# EAGLE design GCD_MiniMoto_v2 (EAGLE 6.3)
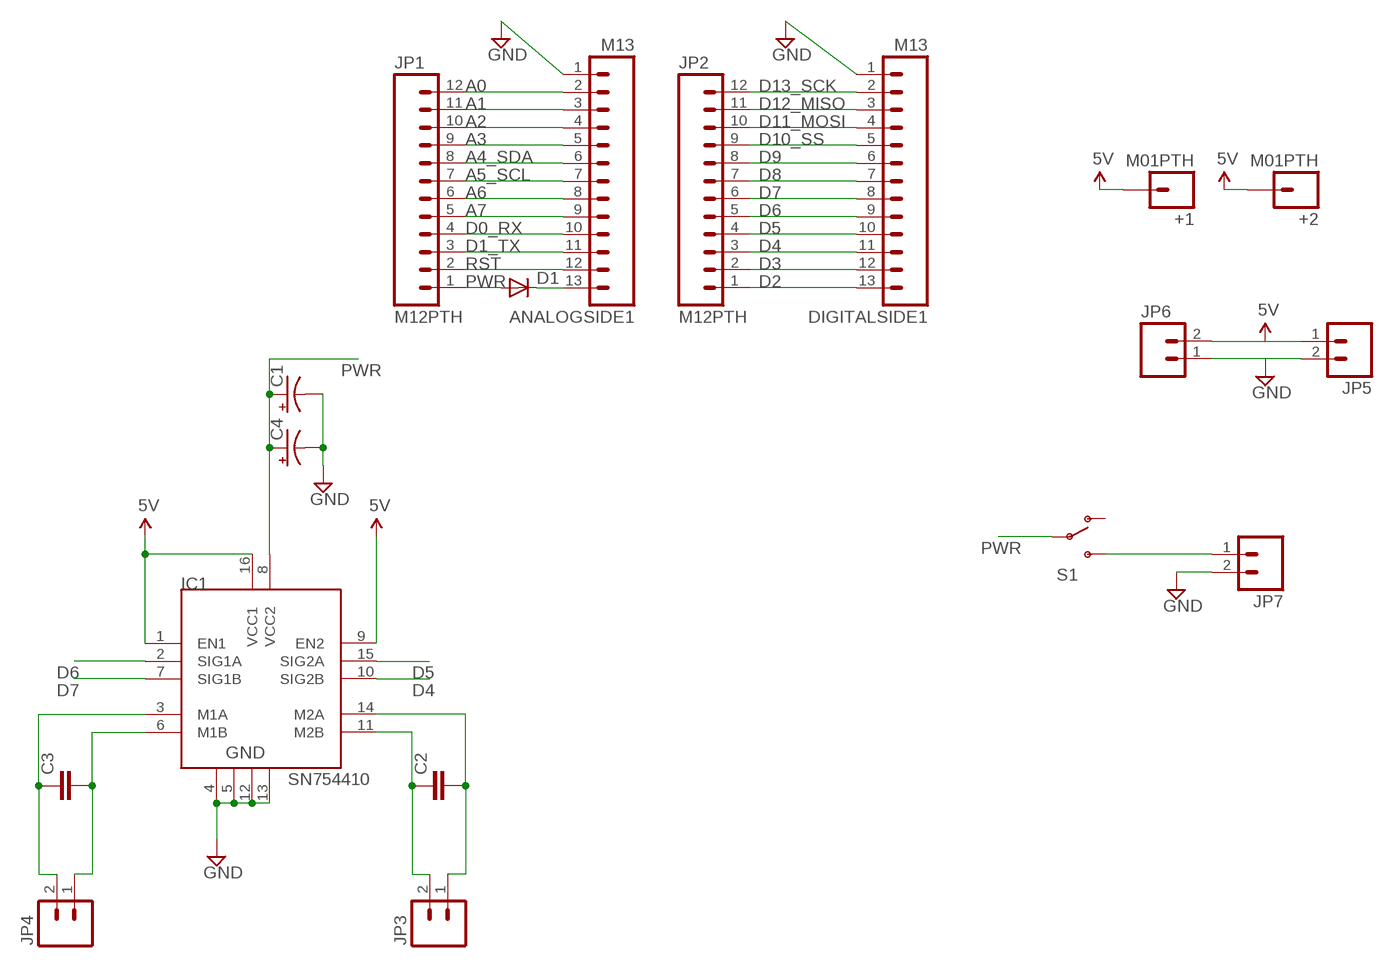
[diagram p0: schematic, sheet 1]

## Parts
+1  M01PTH  [1X01]
+2  M01PTH  [1X01]
ANALOGSIDE1  M13  [1X13]
C1  CAP_POLPTH1  [CPOL-RADIAL-100UF-25V]
C2  CAPPTH1  [CAP-PTH-5MM]
C3  CAPPTH1  [CAP-PTH-5MM]
C4  CAP_POLPTH1  [CPOL-RADIAL-100UF-25V]
D1  DIODESOD  [SOD-323]
DIGITALSIDE1  M13  [1X13]
IC1  SN754410  [DIP16]
JP1  M12PTH  [1X12]
JP2  M12PTH  [1X12]
JP3  M025MM  [SCREWTERMINAL-5MM-2]
JP4  M025MM  [SCREWTERMINAL-5MM-2]
JP5  M02PTH  [1X02]
JP6  M02PTH  [1X02]
JP7  M02PTH  [1X02]
S1  SWITCH-SPDTPTH  [SWITCH-SPDT]

## Nets
5V: +1.1 +2.1 IC1.1(EN1) IC1.9(EN2) IC1.16(VCC1) JP5.1 JP6.2
A0: ANALOGSIDE1.2 JP1.12
A1: ANALOGSIDE1.3 JP1.11
A2: ANALOGSIDE1.4 JP1.10
A3: ANALOGSIDE1.5 JP1.9
A4_SDA: ANALOGSIDE1.6 JP1.8
A5_SCL: ANALOGSIDE1.7 JP1.7
A6: ANALOGSIDE1.8 JP1.6
A7: ANALOGSIDE1.9 JP1.5
D0_RX: ANALOGSIDE1.10 JP1.4
D1_TX: ANALOGSIDE1.11 JP1.3
D2: DIGITALSIDE1.13 JP2.1
D3: DIGITALSIDE1.12 JP2.2
D4: DIGITALSIDE1.11 IC1.10(SIG2B) JP2.3
D5: DIGITALSIDE1.10 IC1.15(SIG2A) JP2.4
D6: DIGITALSIDE1.9 IC1.2(SIG1A) JP2.5
D7: DIGITALSIDE1.8 IC1.7(SIG1B) JP2.6
D8: DIGITALSIDE1.7 JP2.7
D9: DIGITALSIDE1.6 JP2.8
D10_SS: DIGITALSIDE1.5 JP2.9
D11_MOSI: DIGITALSIDE1.4 JP2.10
D12_MISO: DIGITALSIDE1.3 JP2.11
D13_SCK: DIGITALSIDE1.2 JP2.12
GND [power]: ANALOGSIDE1.1 C1.2(-) C4.2(-) DIGITALSIDE1.1 IC1.4 IC1.5 IC1.12 IC1.13 JP5.2 JP6.1 JP7.2
N$1: C3.1 IC1.3(M1A) JP4.2
N$2: C3.2 IC1.6(M1B) JP4.1
N$3: JP7.1 S1.3(S)
N$4: C2.1 IC1.11(M2B) JP3.2
N$5: C2.2 IC1.14(M2A) JP3.1
N$6: ANALOGSIDE1.13 D1.1(C)
PWR [power]: C1.1(+) C4.1(+) D1.2(A) IC1.8(VCC2) JP1.1 S1.2(P)
RST: ANALOGSIDE1.12 JP1.2
Unconnected: S1.1(O)

## Library data of the parts
+1 +2 = SparkFun-Connectors:M01: Header 1 Standard 1-pin 0.1" header. Use with straight break away headers (SKU : PRT-00116), right angle break away headers (PRT-00553), swiss pins (PRT-00743), machine pins (PRT-00117), and female headers (PRT-00115).
ANALOGSIDE1 DIGITALSIDE1 = SparkFun-Connectors:M13: 13-pin single row .1" header
C1 C4 = SparkFun-Capacitors:CAP_POL: Capacitor Polarized These are standard SMD and PTH capacitors. Normally 10uF, 47uF, and 100uF in electrolytic and tantalum varieties. Always verify the external diameter of the through hole cap, it varies with capacity, voltage, and manufacturer. The EIA devices should be standard.
C2 C3 = SparkFun-Capacitors:CAP: Capacitor Standard 0603 ceramic capacitor, and 0.1" leaded capacitor.
D1 = SparkFun-DiscreteSemi:DIODE: Diode These are standard reverse protection diodes and small signal diodes. SMA package can handle up to about 1A. SOD-323 can handle about 200mA. What the SOD-323 package when ordering, there are some mfgs out there that are 5-pin packages.
IC1 = HBridge:SN754410: Quadruple half-H driver
JP1 JP2 = SparkFun-Connectors:M12: Header 12 Standard 12-pin 0.1" header. Use with straight break away headers (SKU : PRT-00116), right angle break away headers (PRT-00553), swiss pins (PRT-00743), machine pins (PRT-00117), and female headers (PRT-00115).
JP3-JP7 = SparkFun-Connectors:M02: Header 2 Standard 2-pin 0.1" header. Use with straight break away headers (SKU : PRT-00116), right angle break away headers (PRT-00553), swiss pins (PRT-00743), machine pins (PRT-00117), and female headers (PRT-00115). Molex polarized connector foot print use with SKU : PRT-08233 with associated crimp pins and housings.
S1 = SparkFun-Electromechanical:SWITCH-SPDT: SPST Switch Simple slide switch. Spark Fun Electronics SKU : COM-00102

## Net classes
1 power: width 0.381 mm, clearance 0.254 mm

## Board
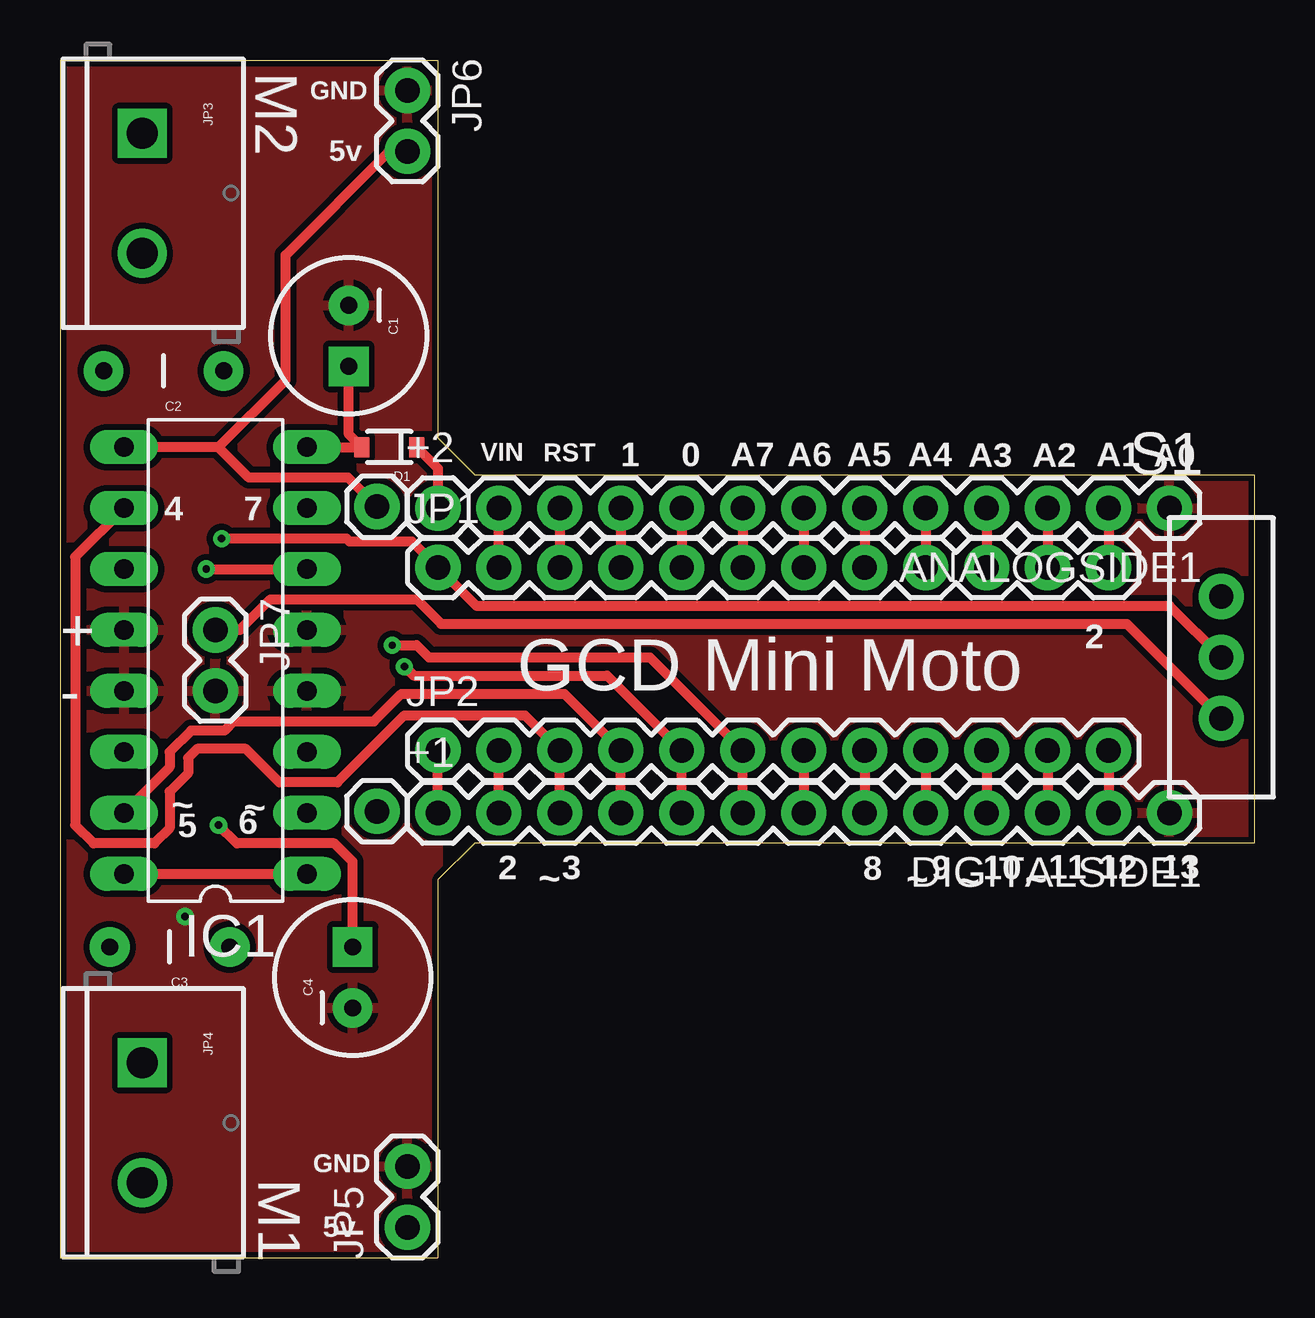
[diagram p1: board, top side]
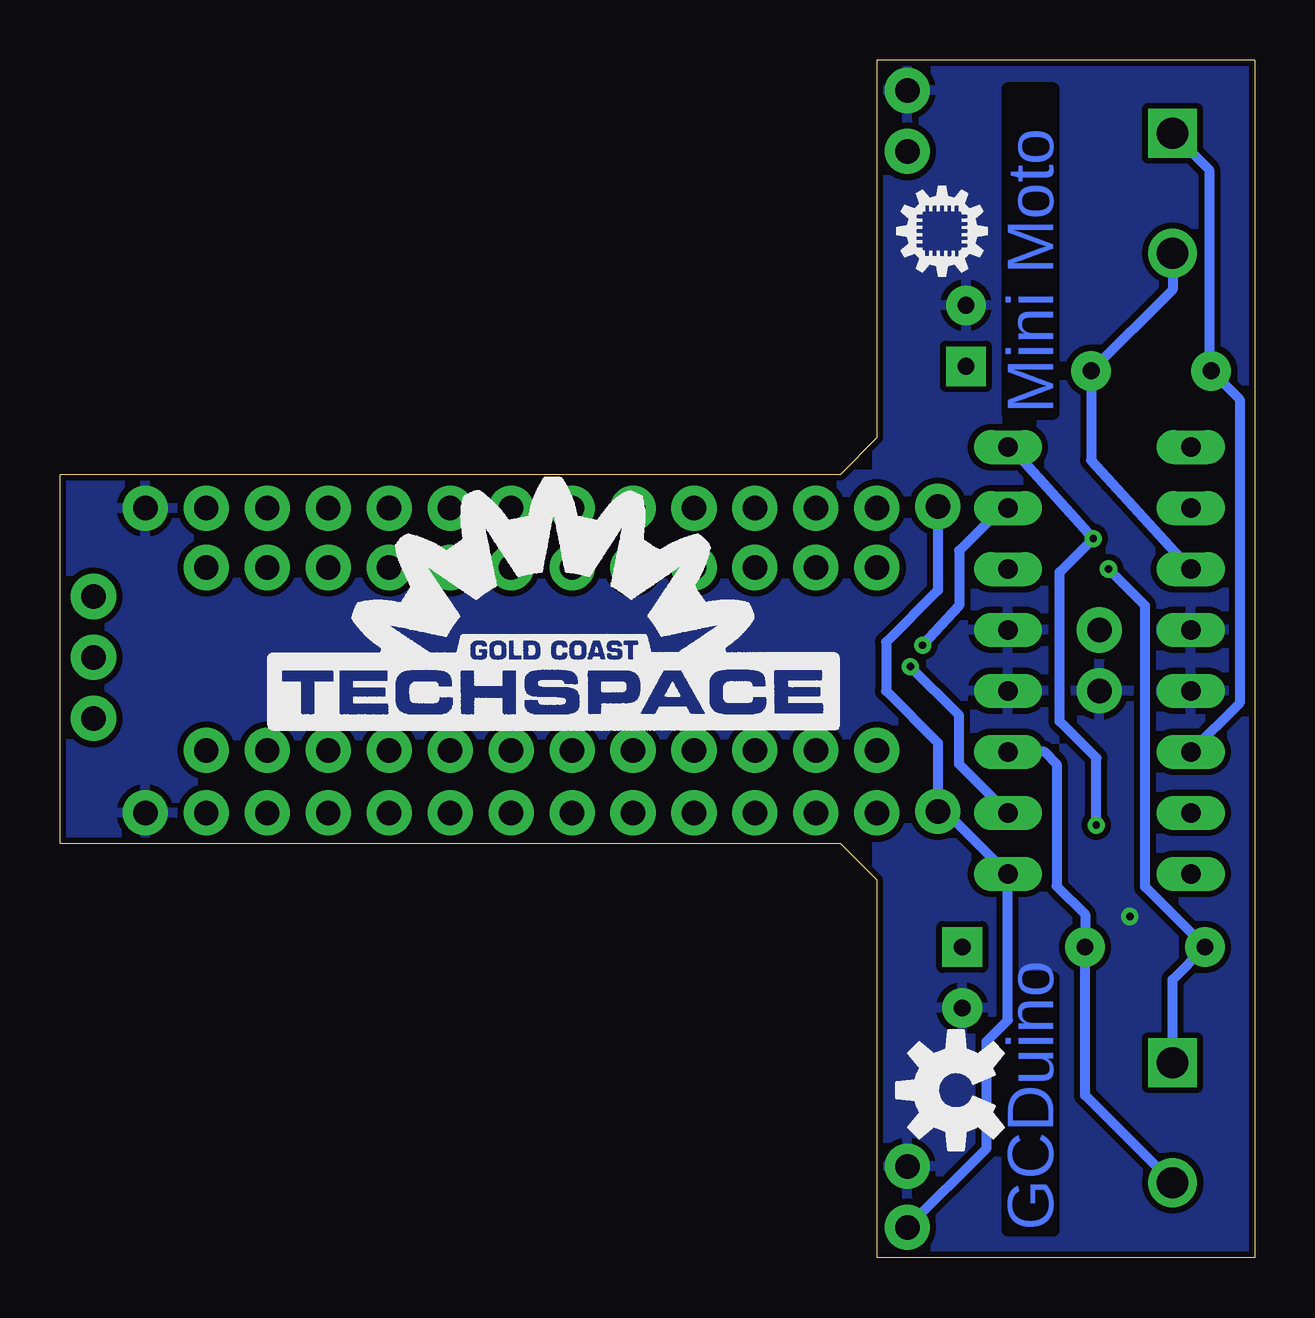
[diagram p2: board, bottom side, seen from below]

Size 49.78 x 49.91 mm. Coordinates in mm from the lower left corner, seen from the top.
Outline: 49.78,17.27 49.78,32.64 17.27,32.64 15.75,34.16 15.75,49.91 0,49.91 0,0 15.75,0 15.75,15.75 17.27,17.27 49.78,17.27
Copper layers (1*16): Top 0.035mm / dielectric 1.5mm / Bottom 0.035mm
Design rules "default": minimum track width 6mil, minimum drill 12mil, track to track 6mil, track to pad 6mil, pad to pad 6mil, via to via 6mil, smd to smd 0mil, copper to edge 10mil, drill to drill 10mil, minimum pad ring 12mil, minimum via ring 8mil, stop-mask expansion 2mil, vias tented up to drill 25mil, thermal gap 10mil

### Footprints (pad centres in the part's own frame; a part is rotated, then mirrored left to right if it is on the bottom)
1X01 = drill 1.016 pad 1.88: 1 0,0
1X13 = drill 1.016 pad 1.88: 1 0,0; 2 2.54,0; 3 5.08,0; 4 7.62,0; 5 10.16,0; 6 12.7,0; 7 15.24,0; 8 17.78,0; 9 20.32,0; 10 22.86,0; 11 25.4,0; 12 27.94,0; 13 30.48,0
CPOL-RADIAL-100UF-25V = drill 0.7 pad 1.651 square: 1 1.27,0 | drill 0.7 pad 1.651: 2 -1.27,0
CAP-PTH-5MM = drill 0.7 pad 1.651: 1 -2.5,0; 2 2.5,0
SOD-323 = smd 0.63 x 0.83: 1 -1.15,0; 2 1.15,0
DIP16 = drill 0.813 long: 1 -10.16,-3.81; 2 -7.62,-3.81; 3 -5.08,-3.81; 4 -2.54,-3.81; 5 0,-3.81; 6 2.54,-3.81; 7 5.08,-3.81; 8 7.62,-3.81; 9 7.62,3.81; 10 5.08,3.81; 11 2.54,3.81; 12 0,3.81; 13 -2.54,3.81; 14 -5.08,3.81; 15 -7.62,3.81; 16 -10.16,3.81
1X12 = drill 1.016 pad 1.88: 1 0,0; 2 2.54,0; 3 5.08,0; 4 7.62,0; 5 10.16,0; 6 12.7,0; 7 15.24,0; 8 17.78,0; 9 20.32,0; 10 22.86,0; 11 25.4,0; 12 27.94,0
SCREWTERMINAL-5MM-2 = drill 1.3 pad 2.032 square: 1 0,0 | drill 1.3 pad 2.032: 2 5,0
1X02 = drill 1.016 pad 1.88: 1 0,0; 2 2.54,0
SWITCH-SPDT = drill 1.016 pad 1.88: 1 0,2.54; 2 0,0; 3 0,-2.54

### Placement (x,y rotation side)
+1  13.21,18.61 0 top
+2  13.21,31.31 0 top
ANALOGSIDE1  46.23,31.24 180 top
C1  12.03,38.42 270 top
C2  4.32,36.96 180 top
C3  4.57,12.95 180 top
C4  12.19,11.68 90 top
D1  13.72,33.78 180 top
DIGITALSIDE1  46.23,18.54 180 top
IC1  6.48,26.16 90 top
JP1  15.75,28.77 0 top
JP2  15.75,21.15 0 top
JP3  3.43,46.86 270 top
JP4  3.43,8.13 270 top
JP5  14.48,1.27 90 top
JP6  14.48,48.64 270 top
JP7  6.48,26.16 270 top
S1  48.39,25.02 0 top
U$5  [GCTS_X0.5_TSILK]  41.15,21.84 0 bottom
U$6  [ID_LOGO_X0.15]  13.08,42.8 0 bottom
U$7  [OSHW-LOGO-M]  12.45,6.99 90 bottom

### Tracks (layer width: path | path; a pad name or v marks a point on that pad's centre or on a via)
5V
  Top 0.406: 6.6,33.78 IC1.9 | IC1.16 IC1.1 | 6.6,33.78 9.4,36.58 9.4,41.78 13.72,46.1 JP6.2 | +2.1 12,32.51 7.87,32.51 6.6,33.78
  Bottom 0.406: JP5.1 11.18,4.57 11.18,9.02 10.29,9.91 IC1.1 12.89,18.61 +1.1 13.21,21.46 15.37,23.62 15.37,25.65 13.21,27.81 +2.1
A0
  Top 0.406: ANALOGSIDE1.2 JP1.12
A1
  Top 0.406: ANALOGSIDE1.3 JP1.11
A2
  Top 0.406: ANALOGSIDE1.4 JP1.10
A3
  Top 0.406: ANALOGSIDE1.5 JP1.9
A4_SDA
  Top 0.406: ANALOGSIDE1.6 JP1.8
A5_SCL
  Top 0.406: ANALOGSIDE1.7 JP1.7
A6
  Top 0.406: ANALOGSIDE1.8 JP1.6
A7
  Top 0.406: ANALOGSIDE1.9 JP1.5
D0_RX
  Top 0.406: ANALOGSIDE1.10 JP1.4
D1_TX
  Top 0.406: ANALOGSIDE1.11 JP1.3
D2
  Top 0.406: DIGITALSIDE1.13 JP2.1
D3
  Top 0.406: DIGITALSIDE1.12 JP2.2
D4
  Top 0.406: IC1.10 0.64,29.21 0.64,18.03 1.4,17.27 3.94,17.27 4.57,17.91 4.57,19.43 5.33,20.19 5.33,20.83 5.71,21.21 7.75,21.21 9.14,19.81 11.56,19.81 14.35,22.61 19.37,22.61 JP2.3 DIGITALSIDE1.11
D5
  Top 0.406: DIGITALSIDE1.10 JP2.4 21.02,23.5 14.22,23.5 13.08,22.35 7.24,22.35 6.86,21.97 5.46,21.97 4.57,21.08 4.57,20.45 IC1.15
D6  (via drill 0.3)
  Top 0.406: v14.35,24.64 14.73,24.26 22.8,24.26 JP2.5 DIGITALSIDE1.9
  Bottom 0.406: IC1.2 12.32,20.57 12.32,22.61 v14.35,24.64
D7  (via drill 0.3)
  Top 0.406: v13.84,25.53 14.86,25.53 15.37,25.02 24.57,25.02 JP2.6 DIGITALSIDE1.8
  Bottom 0.406: IC1.7 10.54,31.24 12.32,29.46 12.32,27.18 v13.84,25.53
D8
  Top 0.406: JP2.7 DIGITALSIDE1.7
D9
  Top 0.406: JP2.8 DIGITALSIDE1.6
D10_SS
  Top 0.406: JP2.9 DIGITALSIDE1.5
D11_MOSI
  Top 0.406: JP2.10 DIGITALSIDE1.4
D12_MISO
  Top 0.406: JP2.11 DIGITALSIDE1.3
D13_SCK
  Top 0.406: JP2.12 DIGITALSIDE1.2
GND  (via drill 0.3)
  other vias: 5.21,14.22
  pour Top (isolate 0.16): 0,49.91 15.75,49.91 15.75,32.64 49.78,32.64 49.78,17.27 15.75,17.27 15.75,0 0,0
  pour Bottom (isolate 0.16): 0,49.91 15.75,49.91 15.75,32.64 49.78,32.64 49.78,17.27 15.75,17.27 15.75,0 0,0
N$1
  Bottom 0.406: JP4.2 7.07,6.77 C3.1 7.07,14.31 8.26,15.49 8.26,20.57 8.76,21.08 IC1.3
N$2  (via drill 0.3)
  Top 0.406: v6.1,28.7 IC1.6
  Bottom 0.406: JP4.1 3.43,11.6 C3.2 4.57,15.45 4.57,27.18 v6.1,28.7
N$3
  Top 0.406: JP7.1 7.49,26.16 8.76,27.43 14.86,27.43 15.88,26.42 44.45,26.42 S1.3
N$4
  Bottom 0.406: JP3.2 3.43,41.27 3.43,40.35 C2.1 6.82,33.23 IC1.11
N$5
  Bottom 0.406: JP3.1 1.91,45.34 1.91,37.04 C2.2 0.64,35.77 0.64,23.11 IC1.14
N$6
  Top 0.406: D1.1 15.75,32.9 ANALOGSIDE1.13
PWR  (via drill 0.3)
  Top 0.406: v6.73,29.97 11.94,29.97 12.06,29.84 14.67,29.84 JP1.1 17.34,27.18 46.23,27.18 S1.2 | IC1.8 D1.2 12.03,34.31 C1.1 | C4.1 12.19,16.51 11.43,17.27 7.37,17.27 v6.6,18.03
  Bottom 0.406: IC1.8 10.16,33.78 v6.73,29.97 8.13,28.57 8.13,22.35 6.6,20.83 v6.6,18.03
RST
  Top 0.406: JP1.2 ANALOGSIDE1.12

### Text on the board
Bottom: Mini Moto | GCDuino
tPlace: M2 | GND | 5v | 4 | 7 | 2 | + | GCD Mini Moto | - | 5 | 6 | ~ | ~ | GND | M1 | 5v
tNames: VIN | 1 | 0 | A7 | A6 | A5 | A4 | A3 | A2 | A1 | RST | A0 | 2 | 3 | 8 | 9 | 10 | 11 | 12 | 13 | ~ | ~ | ~ | ~
tDocu: REG
_bsilk: VIN | 3.3 | 1 | 0 | A7 | A6 | A5 | A4 | A3 | A2 | A1 | A0 | GND | ANT | DTR | GND | 3.3 | + | AREF | GND | 2 | 3 | 4 | 5 | 6 | 7 | 8 | 9 | 10 | 11 | 12 | 13 | RST